# Altium schematic sheet Main.SchDoc
size A
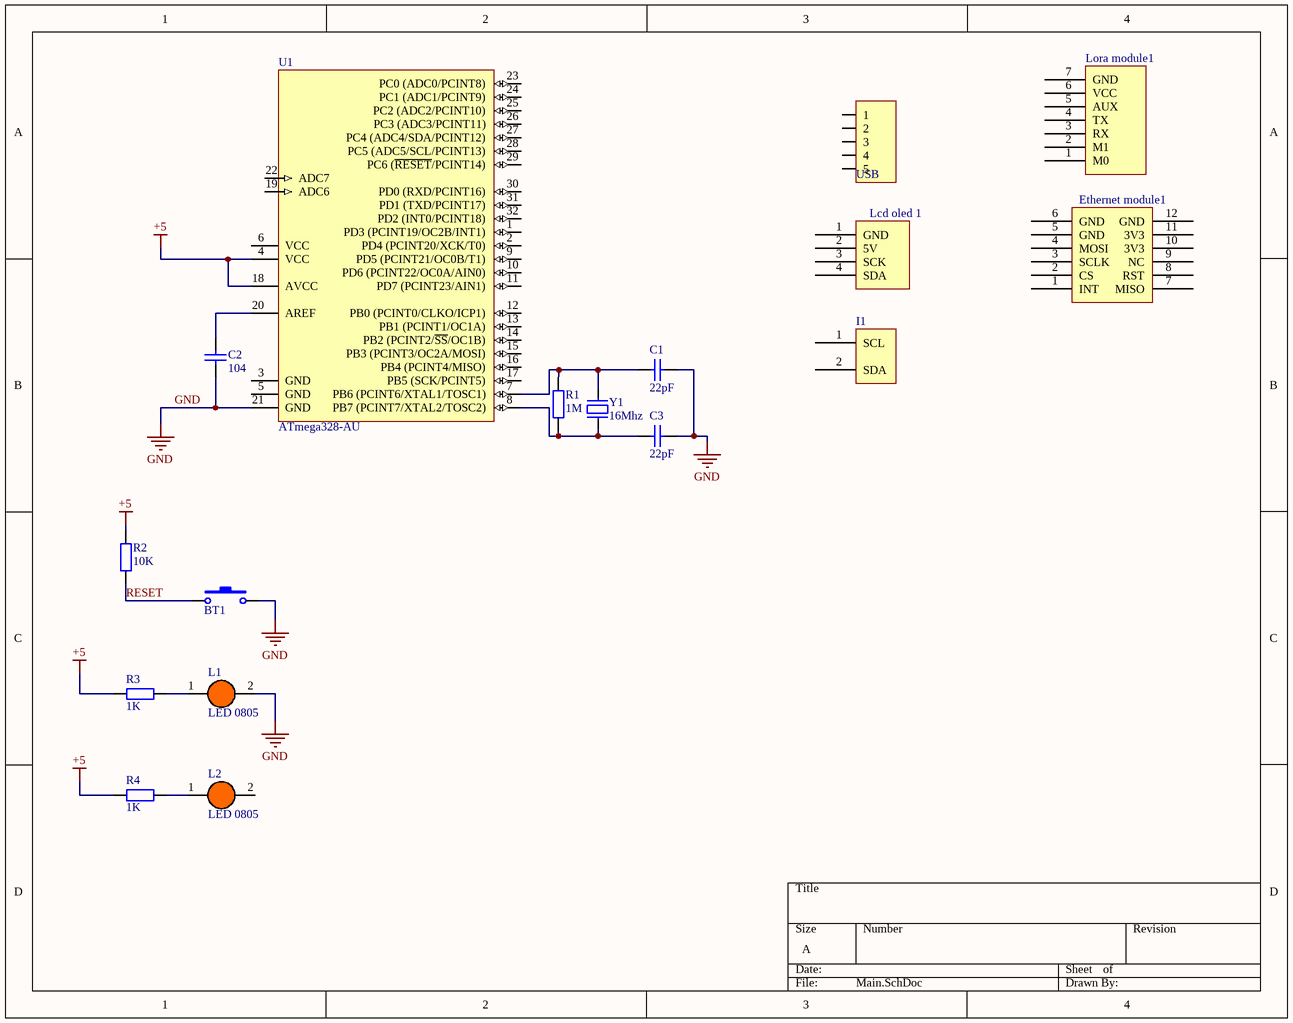
[diagram p0: Main.SchDoc]

## Parts
BT1  Nut Nhan 2 Chan SMD 3x6x2.5  [Nut Nhan 2 Chan SMD 3x6x2.5]  (value not drawn)
C1  22pF  [tu 0603]
C2  104  [tu 0603]
C3  22pF  [tu 0603]
Ethernet_module1  Ethernet module  [Ethernet module - duplicate]  (value not drawn)
I1  I2C  [CON2]  (value not drawn)
JP1  USB  [JP 1x5 CT]
L1  LED 0805  [LED-0805-Orange]
L2  LED 0805  [LED-0805-Orange]
Lcd_oled_1  Lcd oled 1306 module  [LCD 1306 - duplicate]  (value not drawn)
Lora_module1  Lora module  [LORA]  (value not drawn)
R1  1M  [tro smd 0805]
R2  10K  [tro smd 0603]
R3  1K  [tro smd 0603]
R4  1K  [tro smd 0603]
U1  ATmega328-AU  [TQFP32]
Y1  16Mhz  [Thach Anh 2 chan SMD]

## Nets
+5: R2.2 R3.1 R4.1 U1.4(VCC) U1.18(AVCC)
GND: BT1.2 C1.2 C2.2 C3.2 L1.2(K) U1.21(GND)
RESET: BT1.1 R2.1
NetC1_1: C1.1 U1.7(PB6_(PCINT6/XTAL1/TOSC1)) Y1.1
NetC2_1: C2.1 U1.20(AREF)
NetC3_1: C3.1 R1.2 U1.8(PB7_(PCINT7/XTAL2/TOSC2)) Y1.2
NetL1_1: L1.1(A) R3.2
NetL2_1: L2.1(A) R4.2

Not connected (* = marked no-connect by the designer): Ethernet_module1 1(INT) 2(CS) 3(SCLK) 4(MOSI) 5(GND) 6(GND) 7(MISO) 8(RST) 9(NC) 10(3V3) 11(3V3) 12(GND); I1 1(SCL) 2(SDA); JP1 1 2 3 4 5; L2 2(K); Lcd_oled_1 1(GND) 2(5V) 3(SCK) 4(SDA); Lora_module1 1(M0) 2(M1) 3(RX) 4(TX) 5(AUX) 6(VCC) 7(GND); R1 1; U1 1(PD3_(PCINT19/OC2B/INT1)) 2(PD4_(PCINT20/XCK/T0)) 3(GND) 5(GND) 6(VCC) 9(PD5_(PCINT21/OC0B/T1)) 10(PD6_(PCINT22/OC0A/AIN0)) 11(PD7_(PCINT23/AIN1)) 12(PB0_(PCINT0/CLKO/ICP1)) 13(PB1_(PCINT1/OC1A)) 14(PB2_(PCINT2/~{SS}/OC1B)) 15(PB3_(PCINT3/OC2A/MOSI)) 16(PB4_(PCINT4/MISO)) 17(PB5_(SCK/PCINT5)) 19(ADC6) 22(ADC7) 23(PC0_(ADC0/PCINT8)) 24(PC1_(ADC1/PCINT9)) 25(PC2_(ADC2/PCINT10)) 26(PC3_(ADC3/PCINT11)) 27(PC4_(ADC4/SDA/PCINT12)) 28(PC5_(ADC5/SCL/PCINT13)) 29(PC6_(~{RESET}/PCINT14)) 30(PD0_(RXD/PCINT16)) 31(PD1_(TXD/PCINT17)) 32(PD2_(INT0/PCINT18))

## Library data of the parts
BT1 = Nut Nhan 2 Chan SMD 3x6x2.5: Ma_Hang: MH001036; Ten: Nút Nhấn 2 Chân 3x6x2.5MM SMD
C1 C3 = Tu 0603 22pF 50V 10%: Dán; Don_Vi: Con; So_Chan: 2; Ten_Linh_Kien: Tụ 0603 22pF 50V 10%; Ma_Hang: MH004570; Chung_Loai: Dán; Kieu_Chan: *
C2 = Tu 0603 104 50V 10%: Dán; Don_Vi: Con; So_Chan: 2; Ten_Linh_Kien: Tụ 0603 104-100nF 10% 50V; Ma_Hang: MH004568; Chung_Loai: Dán; Kieu_Chan: *
JP1 = JP 1x5 2.54 Cai Thang: Cắm; Ten_Linh_Kien: Jump Đơn Cái 2.54MM 1x20P Thẳng; Don_Vi: Con; Ma_Hang: MH004006; Ghi_Chu: *; Kieu_Chan: *; Chung_Loai: Cắm
L1 L2 = LED 0805 Cam: Dán; Don_Vi: Con; Ma_Hang: MH002328; Ten_Linh_Kien: LED 0805 Màu Cam ( Orange); Ghi_Chu: *; Kieu_Chan: *; Chung_Loai: Dán
R1 = Tro 0805 5% 1M: Dán; Don_Vi: Con; So_Chan: 2; Ten_Linh_Kien: Trở 0805 5% 1M; Ma_Hang: MH005235; Chung_Loai: Dán; Kieu_Chan: *
R2-R4 = Tro 0603 5% 220R: Dán; Don_Vi: Con; So_Chan: 2; Ten_Linh_Kien: Trở 0603 5% 220R; Ma_Hang: MH006322; Chung_Loai: Dán; Kieu_Chan: *
U1 = ATmega328-AU: 8-bit AVR Microcontroller, 32KB Flash, 1KB EEPROM, 2KB SRAM, 32-pin TQFP, Industrial Grade (-40°C to 85°C); Published: 1-Apr-2010; DatasheetVersion: revA, Jan-2010; PackageVersion: revB, Oct-2001; PackageReference: 32A; Publisher: Altium Limited; PackageDescription: 32-Lead, 7x7x1.0 mm Body, 0.8mm Lead Pitch, Thin Profile Plastic Quad Flat Package (TQFP); Supplier 1: Digi-Key; Supplier Part Number 1: ATMEGA328-AU-ND; Supplier 2: Mouser; Supplier Part Number 2: 556-ATMEGA328-AU; Code_JEDEC: MS-026-ABA; ComponentLink1Description: Manufacturer Link; ComponentLink1URL: http://www.atmel.com/products/avr/default.asp?; ComponentLink2Description: ATmega48A/48PA/88A/88PA/168A/168PA/328/328P Datasheet; ComponentLink2URL: http://www.atmel.com/dyn/resources/prod_documents/8271.pdf; ComponentLink3Description: ATmega48A/48PA/88A/88PA/168A/168PA/328/328P Summary; ComponentLink3URL: http://www.atmel.com/dyn/resources/prod_documents/8271S.pdf; ComponentLink4Description: Atmel.com Home; ComponentLink4URL: http://www.atmel.com
Y1 = Thach Anh 2 chan SMD: Crystal For all Crystal 2pin.; Value: 4Mhz